# Altium schematic sheet datalogging.SchDoc
size A4; SheetNumber: 11; SheetTotal: 12
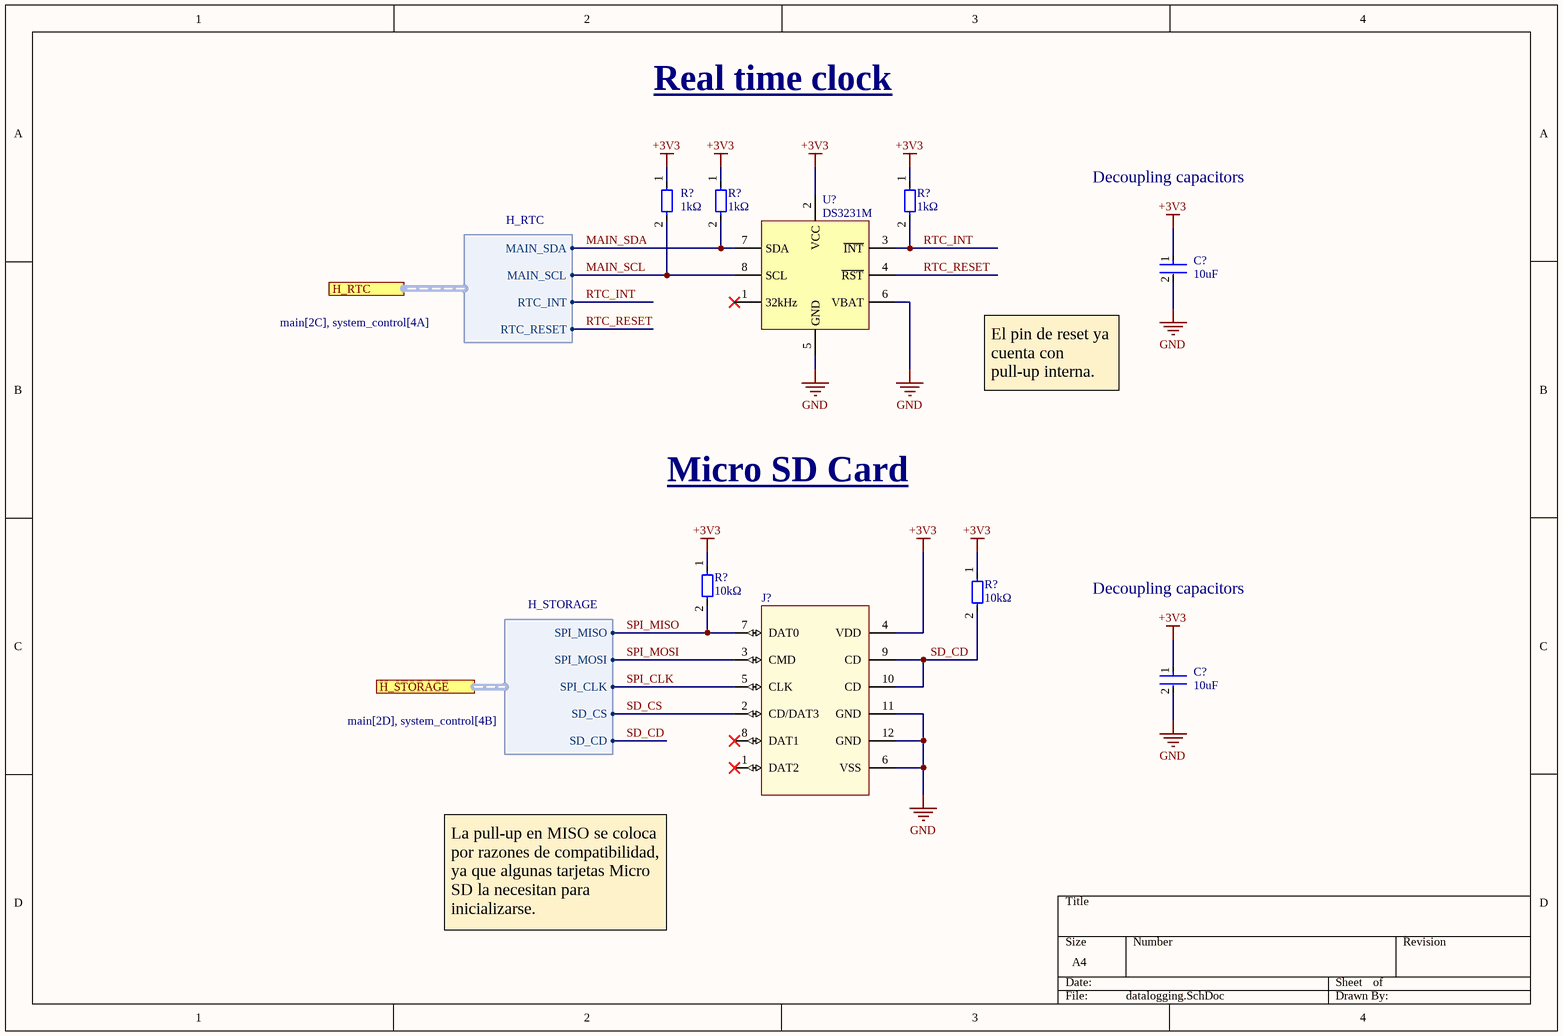
[diagram p0: datalogging.SchDoc]

## Parts
(Parts that share a designator on the sheet are numbered #1, #2 ... from top to bottom, then left to right.)
C?#1  Capacitance: 10uF  [CAP_0805]  (hidden comment: Simbolo de capacitor genérico)
C?#2  Capacitance: 10uF  [CAP_0805]  (hidden comment: Simbolo de capacitor genérico)
J?  MEM2061-01-188-00-A_revA  [MEM2061-01-188-00-A_revA]  (value not drawn)
R?#1  value 1kΩ  [RES_0805]  (hidden comment: Simbolo de resistencia genérica)
R?#2  value 1kΩ  [RES_0805]  (hidden comment: Simbolo de resistencia genérica)
R?#3  value 1kΩ  [RES_0805]  (hidden comment: Simbolo de resistencia genérica)
R?#4  value 10kΩ  [RES_0805]  (hidden comment: Simbolo de resistencia genérica)
R?#5  value 10kΩ  [RES_0805]  (hidden comment: Simbolo de resistencia genérica)
U?  DS3231M  [SOIC8]

## Ports
H_RTC (harness H_RTC, see main[2C], system_control[4A]), H_STORAGE (harness H_STORAGE, see main[2D], system_control[4B])

## Harnesses
H_RTC: MAIN_SDA, MAIN_SCL, RTC_INT, RTC_RESET
H_STORAGE: SPI_MISO, SPI_MOSI, SPI_CLK, SD_CS, SD_CD

## Nets
+3V3: C?#1.1 C?#2.1 J?.4(VDD) R?#1.1 R?#2.1 R?#3.1 R?#4.1 R?#5.1 U?.2(VCC)
GND: C?#1.2 C?#2.2 J?.6(VSS) J?.11(GND) J?.12(GND) U?.5(GND) U?.6(VBAT)
MAIN_SCL: R?#1.2 U?.8(SCL) ; port H_RTC.MAIN_SCL
MAIN_SDA: R?#2.2 U?.7(SDA) ; port H_RTC.MAIN_SDA
RTC_INT: R?#3.2 U?.3(~{INT}) ; port H_RTC.RTC_INT
RTC_RESET: U?.4(~{RST}) ; port H_RTC.RTC_RESET
SD_CD: J?.9(CD) J?.10(CD) R?#5.2 ; port H_STORAGE.SD_CD
SD_CS: J?.2(CD/DAT3) ; port H_STORAGE.SD_CS
SPI_CLK: J?.5(CLK) ; port H_STORAGE.SPI_CLK
SPI_MISO: J?.7(DAT0) R?#4.2 ; port H_STORAGE.SPI_MISO
SPI_MOSI: J?.3(CMD) ; port H_STORAGE.SPI_MOSI

Not connected (* = marked no-connect by the designer): J? 1(DAT2)* 8(DAT1)*; U? 1(32kHz)*

## Notes on the sheet
- Real time clock
- Decoupling capacitors
- El pin de reset ya cuenta con pull-up interna.
- Micro SD Card
- La pull-up en MISO se coloca por razones de compatibilidad, ya que algunas tarjetas Micro SD la necesitan para inicializarse.

## Library data of the parts
C?#1 C?#2 = Generic C: Dielectric: X5R; Voltage Rating: 10V; Tolerance: 10%; Case Code (Imperial): 0805; Mount: Surface Mount; Depth: 1.25mm; Length: 2mm; Lead Free: Lead Free; Packaging: Tape and Reel; Width: 0.049inch; Package Quantity: 1; Height: 1.25mm; Case/Package: 0805; Thickness: 0.053inch; Max Operating Temperature: 85°C; Case Code (Metric): 2012; Contact Plating: Tin; Min Operating Temperature: -55°C; Radiation Hardening: No; Voltage Rating (DC): 10V
J? = MEM2061-01-188-00-A_revA: Micro SD Memory Card Connector, 1.88mm Profile SMT,Push Push, with normally closed switch; Manufacturer: GCT; Insertion, Removal Method: Push In, Push Out; MPN: MEM2061-01-188-00-A; Mounting Type: Surface Mount, Right Angle; Datasheet: https://gct.co/files/specs/mem2061-spec.pdf
R?#1-R?#5 = Generic R
U? = DS3231M: Real Time Clock (RTC) IC Clock/Calendar I2C, 2-Wire Serial 8-SOIC (0.154", 3.90mm Width); Manufacturer: Analog Devices; MPN: DS3231MZ+TRL; Voltage - Supply: 2.3V ~ 5.5V; Current - Timekeeping (Max): 130µA ~ 200µA @ 3.63V ~ 5.5V; Interface: I2C; Features: Alarm, Leap Year, Square Wave Output; Voltage - Supply, Battery: 2.3V ~ 5.5V; Operating Temperature: -40°C ~ 85°C; Package: 8-SOIC; Datasheet: https://www.analog.com/media/en/technical-documentation/data-sheets/DS3231M.pdf